# Altium schematic sheet Module_AFE.SchDoc
size A4
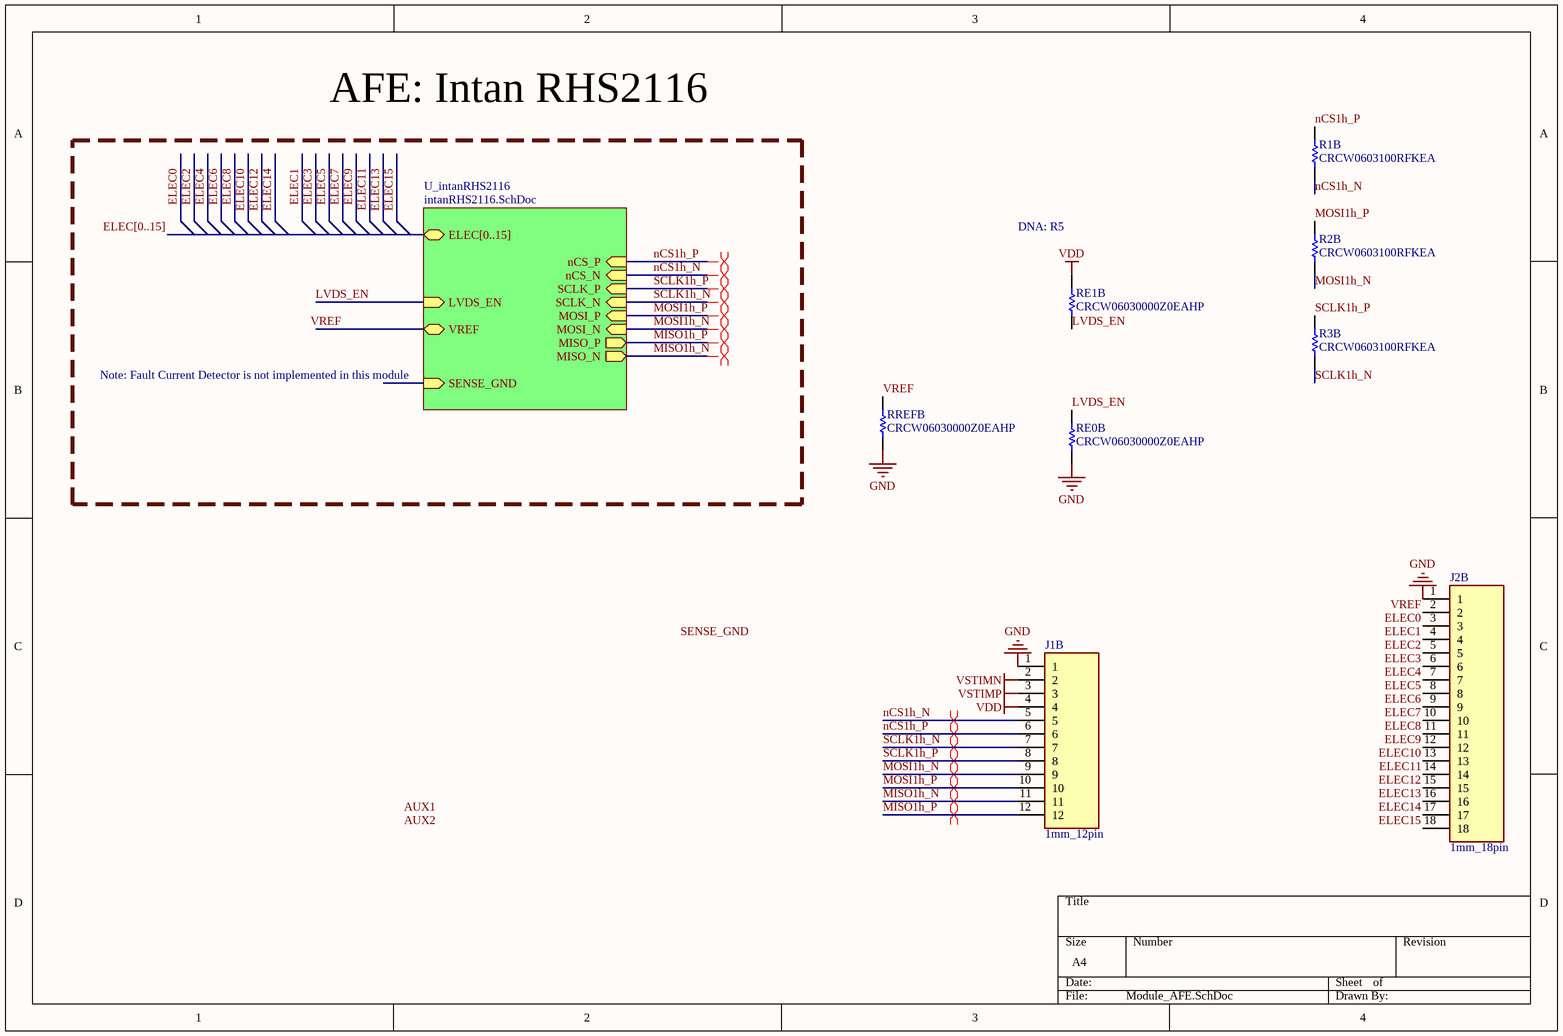
[diagram p0: Module_AFE.SchDoc]

## Parts
J1B  1mm_12pin  [1mm_12pin]
J2B  1mm_18pin  [1mm_18pin]
R1B  CRCW0603100RFKEA  [RESC1609X50X30ML8T20]
R2B  CRCW0603100RFKEA  [RESC1609X50X30ML8T20]
R3B  CRCW0603100RFKEA  [RESC1609X50X30ML8T20]
RE0B  CRCW06030000Z0EAHP  [RESC1609X55X30NL10T20]
RE1B  CRCW06030000Z0EAHP  [RESC1609X55X30NL10T20]
RREFB  CRCW06030000Z0EAHP  [RESC1609X55X30NL10T20]

## Sub-sheets
U_intanRHS2116 = intanRHS2116.SchDoc: nCS_N (in), nCS_P (in), SCLK_N (in), SCLK_P (in), MOSI_N (in), MOSI_P (in), MISO_N (out), MISO_P (out), ELEC[0..15] (bidir), LVDS_EN (in), VREF (bidir), SENSE_GND (in)

## Nets
GND: J1B.1 J2B.1 RE0B.1 RREFB.1
VDD: J1B.4 RE1B.2
VSTIMN: J1B.2
VSTIMP: J1B.3
ELEC0: J2B.3
ELEC1: J2B.4
ELEC2: J2B.5
ELEC3: J2B.6
ELEC4: J2B.7
ELEC5: J2B.8
ELEC6: J2B.9
ELEC7: J2B.10
ELEC8: J2B.11
ELEC9: J2B.12
ELEC10: J2B.13
ELEC11: J2B.14
ELEC12: J2B.15
ELEC13: J2B.16
ELEC14: J2B.17
ELEC15: J2B.18
LVDS_EN: RE0B.2 RE1B.1 ; sheet U_intanRHS2116/LVDS_EN
MISO1h_N: J1B.11 ; sheet U_intanRHS2116/MISO_N
MISO1h_P: J1B.12 ; sheet U_intanRHS2116/MISO_P
MOSI1h_N: J1B.9 R2B.1 ; sheet U_intanRHS2116/MOSI_N
MOSI1h_P: J1B.10 R2B.2 ; sheet U_intanRHS2116/MOSI_P
nCS1h_N: J1B.5 R1B.1 ; sheet U_intanRHS2116/nCS_N
nCS1h_P: J1B.6 R1B.2 ; sheet U_intanRHS2116/nCS_P
SCLK1h_N: J1B.7 R3B.1 ; sheet U_intanRHS2116/SCLK_N
SCLK1h_P: J1B.8 R3B.2 ; sheet U_intanRHS2116/SCLK_P
VREF: J2B.2 RREFB.2 ; sheet U_intanRHS2116/VREF

## Buses and harness runs
bus ELEC[0..15] = sheet U_intanRHS2116/ELEC[0..15]

## Layout directives
differential pair: MISO1h_N, MISO1h_P, MOSI1h_N, MOSI1h_P, nCS1h_N, nCS1h_P, SCLK1h_N, SCLK1h_P

## Notes on the sheet
- AFE: Intan RHS2116
- DNA: R5
- Note: Fault Current Detector is not implemented in this module
- Labels drawn without touching a wire or pin: AUX1, AUX2, SENSE_GND

## Library data of the parts
R1B R2B R3B = CMP-1666-00008-4: Chip Resistor, 100 Ohm, +/- 1%, 100 mW,-55 to 155 degC, 0603 (1608 Metric), RoHS, Tape and Ree; Manufacturer: Vishay Semiconductor; ComponentLink2URL: http://www.vishay.com/docs/20035/dcrcwe3.pdf; ComponentLink1URL: http://www.vishay.com/; Mounting Technology: Surface Mount; ComponentLink1Description: Manufacturer URL; ComponentLink2Description: Datasheet; PackageDescription: 2-Pin Surface Mount Device, Body 1.575 x 0.85 mm; PackageReference: 0603; DatasheetVersion: 06/2012
RE0B RE1B RREFB = CMP-2000-03817-1: Manufacturer: Vishay Dale; Part Number: CRCW06030000Z0EAHP